# EAGLE schematic battery_monitor_6803-2_Rev3 (EAGLE 7.3.0)
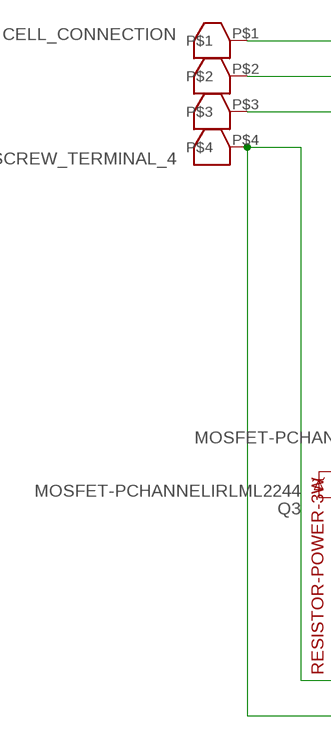
[diagram p0: schematic, sheet 1, part 1 of 2]
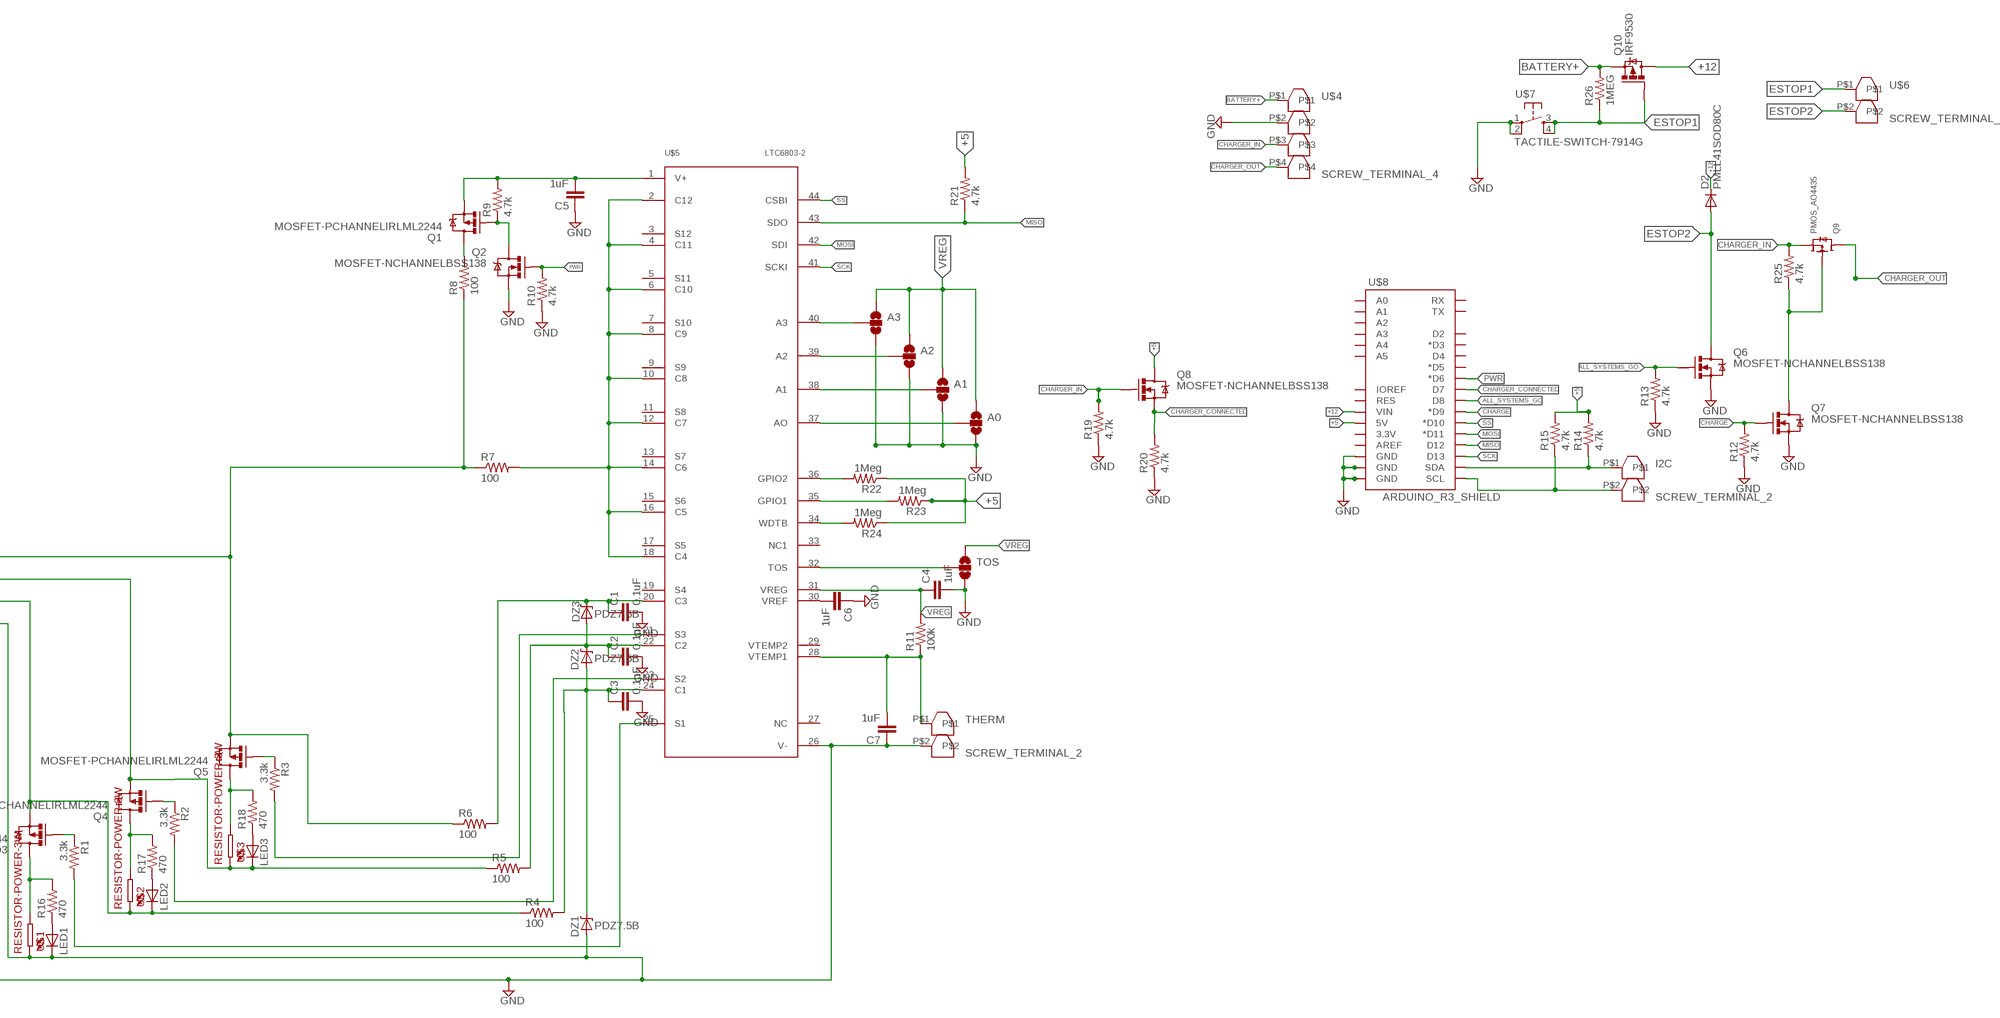
[diagram p1: schematic, sheet 1, part 2 of 2]

## Parts
A0  SOLDERJUMPER_2WAYS  [SJ_3]
A1  SOLDERJUMPER_2WAYS  [SJ_3]
A2  SOLDERJUMPER_2WAYS  [SJ_3]
A3  SOLDERJUMPER_2WAYS  [SJ_3]
C1  0.1uF  0.1UF-100V-10%(0603)  [0603-CAP]
C2  0.1uF  0.1UF-100V-10%(0603)  [0603-CAP]
C3  0.1uF  0.1UF-100V-10%(0603)  [0603-CAP]
C4  1uF  0.1UF-100V-10%(0603)  [0603-CAP]
C5  1uF  0.1UF-100V-10%(0603)  [0603-CAP]
C6  1uF  0.1UF-100V-10%(0603)  [0603-CAP]
C7  1uF  0.1UF-100V-10%(0603)  [0603-CAP]
CELL_CONNECTION  SCREW_TERMINAL_4  [SCREW_TERMINAL_4]
D2  PMLL41SOD80C  [SOD80C]
DZ1  PDZ7.5B  DIODE-ZENER-BZT52  [SOD-323]
DZ2  PDZ7.5B  DIODE-ZENER-BZT52  [SOD-323]
DZ3  PDZ7.5B  DIODE-ZENER-BZT52  [SOD-323]
I2C  SCREW_TERMINAL_2  [SCREW_TERMINAL_2]
LED1  LED0603  [LED-0603]
LED2  LED0603  [LED-0603]
LED3  LED0603  [LED-0603]
Q1  MOSFET-PCHANNELIRLML2244  [SOT23-3]
Q2  MOSFET-NCHANNELBSS138  [SOT23]
Q3  MOSFET-PCHANNELIRLML2244  [SOT23-3]
Q4  MOSFET-PCHANNELIRLML2244  [SOT23-3]
Q5  MOSFET-PCHANNELIRLML2244  [SOT23-3]
Q6  MOSFET-NCHANNELBSS138  [SOT23]
Q7  MOSFET-NCHANNELBSS138  [SOT23]
Q8  MOSFET-NCHANNELBSS138  [SOT23]
Q9  PMOS_AO4435  [SOIC8]
Q10  IRF9530  [TO220BV]
R1  3.3k  3.3KOHM1/10W1%(0603)  [0603-RES]
R2  3.3k  3.3KOHM1/10W1%(0603)  [0603-RES]
R3  3.3k  3.3KOHM1/10W1%(0603)  [0603-RES]
R4  100  3.3KOHM1/10W1%(0603)  [0603-RES]
R5  100  3.3KOHM1/10W1%(0603)  [0603-RES]
R6  100  3.3KOHM1/10W1%(0603)  [0603-RES]
R7  100  3.3KOHM1/10W1%(0603)  [0603-RES]
R8  100  3.3KOHM1/10W1%(0603)  [0603-RES]
R9  4.7k  3.3KOHM1/10W1%(0603)  [0603-RES]
R10  4.7k  3.3KOHM1/10W1%(0603)  [0603-RES]
R11  100k  3.3KOHM1/10W1%(0603)  [0603-RES]
R12  4.7k  3.3KOHM1/10W1%(0603)  [0603-RES]
R13  4.7k  3.3KOHM1/10W1%(0603)  [0603-RES]
R14  4.7k  3.3KOHM1/10W1%(0603)  [0603-RES]
R15  4.7k  3.3KOHM1/10W1%(0603)  [0603-RES]
R16  470  3.3KOHM1/10W1%(0603)  [0603-RES]
R17  470  3.3KOHM1/10W1%(0603)  [0603-RES]
R18  470  3.3KOHM1/10W1%(0603)  [0603-RES]
R19  4.7k  3.3KOHM1/10W1%(0603)  [0603-RES]
R20  4.7k  3.3KOHM1/10W1%(0603)  [0603-RES]
R21  4.7k  3.3KOHM1/10W1%(0603)  [0603-RES]
R22  1Meg  3.3KOHM1/10W1%(0603)  [0603-RES]
R23  1Meg  3.3KOHM1/10W1%(0603)  [0603-RES]
R24  1Meg  3.3KOHM1/10W1%(0603)  [0603-RES]
R25  4.7k  3.3KOHM1/10W1%(0603)  [0603-RES]
R26  1MEG  3.3KOHM1/10W1%(0603)  [0603-RES]
THERM  SCREW_TERMINAL_2  [SCREW_TERMINAL_2]
TOS  SOLDERJUMPER_2WAYS  [SJ_3]
U$1  RESISTOR-POWER-3W  [RESISTOR-3W]
U$2  RESISTOR-POWER-3W  [RESISTOR-3W]
U$3  RESISTOR-POWER-3W  [RESISTOR-3W]
U$4  SCREW_TERMINAL_4  [SCREW_TERMINAL_4]
U$5  LTC6803-2  [FSOP-44]
U$6  SCREW_TERMINAL_2  [SCREW_TERMINAL_2]
U$7  TACTILE-SWITCH-7914G  [7914G]
U$8  ARDUINO_R3_SHIELD  [UNO_R3_SHIELD]

## Nets
+5: Q8.3(D) R14.2 R15.2 R21.2 R22.1 R23.1 R24.1 U$8.5V
+12: D2.C Q10.D U$8.VIN
ALL_SYSTEMS_GO: Q6.1(G) R13.2 U$8.D8
BATTERY+: Q10.S R26.2 U$4.P$1
CHARGE: Q7.1(G) R12.2 U$8.D9(*D9)
CHARGER_CONNECTED: Q8.2(S) R20.2 U$8.D7
CHARGER_IN: Q8.1(G) Q9.1(SOURCE) Q9.2(SOURCE) Q9.3(SOURCE) R19.2 R25.2 U$4.P$3
CHARGER_OUT: Q9.5(DRAIN) Q9.6(DRAIN) Q9.7(DRAIN) Q9.8(DRAIN) U$4.P$4
ESTOP1: Q10.G R26.1 U$6.P$1 U$7.3 U$7.4
ESTOP2: D2.A Q6.3(D) U$6.P$2
GND: A0.3 A1.3 A2.3 A3.3 C1.2 C2.2 C3.2 C4.2 C5.1 C6.1 C7.1 CELL_CONNECTION.P$4 DZ1.2(A) LED1.C Q2.2(S) Q6.2(S) Q7.2(S) R10.1 R12.1 R13.1 R19.1 R20.1 THERM.P$2 TOS.3 U$1.P$2 U$4.P$2 U$5.26(V-) U$7.1 U$7.2 U$8.GND@0(GND) U$8.GND@1(GND) U$8.GND@2(GND)
MISO: R21.1 U$5.43(SDO) U$8.D12
MOSI: U$5.42(SDI) U$8.D11(*D11)
N$1: Q7.3(D) Q9.4(GATE) R25.1
N$2: CELL_CONNECTION.P$3 LED2.C Q3.2(S) R4.1 U$2.P$2
N$3: CELL_CONNECTION.P$2 LED3.C Q4.2(S) R5.1 U$3.P$2
N$4: CELL_CONNECTION.P$1 Q5.2(S) R6.1 R7.1 R8.1
N$5: Q3.3(D) R16.2 U$1.P$1
N$6: R2.2 U$5.23(S2)
N$7: Q3.1(G) R1.1
N$8: R1.2 U$5.25(S1)
N$9: R3.2 U$5.21(S3)
N$10: Q4.3(D) R17.2 U$2.P$1
N$11: Q4.1(G) R2.1
N$12: Q5.3(D) R18.2 U$3.P$1
N$13: LED1.A R16.1
N$14: C1.1 DZ3.1(C) R6.2 U$5.20(C3)
N$15: C3.1 DZ1.1(C) DZ2.2(A) R4.2 U$5.24(C1)
N$16: C2.1 DZ2.1(C) DZ3.2(A) R5.2 U$5.22(C2)
N$17: R7.2 U$5.2(C12) U$5.4(C11) U$5.6(C10) U$5.8(C9) U$5.10(C8) U$5.12(C7) U$5.14(C6) U$5.16(C5) U$5.18(C4)
N$18: Q1.3(D) R8.2
N$19: C5.2 Q1.2(S) R9.2 U$5.1(V+)
N$20: Q1.1(G) Q2.3(D) R9.1
N$21: C7.2 R11.1 THERM.P$1 U$5.28(VTEMP1)
N$22: LED2.A R17.1
N$23: LED3.A R18.1
N$24: R22.2 U$5.36(GPIO2)
N$25: R23.2 U$5.35(GPIO1)
N$27: R24.2 U$5.34(WDTB)
N$28: A3.2 U$5.40(A3)
N$29: Q5.1(G) R3.1
N$30: A2.2 U$5.39(A2)
N$31: A1.2 U$5.38(A1)
N$32: A0.2 U$5.37(AO)
N$33: TOS.2 U$5.32(TOS)
N$34: C6.2 U$5.30(VREF)
PWR: Q2.1(G) R10.2 U$8.D6(*D6)
SCK: U$5.41(SCKI) U$8.D13
SCL: I2C.P$2 R15.1 U$8.SCL
SDA: I2C.P$1 R14.1 U$8.SDA
SS: U$5.44(CSBI) U$8.D10(*D10)
VREG: A0.1 A1.1 A2.1 A3.1 C4.1 R11.2 TOS.1 U$5.31(VREG)
Unconnected: U$5.3(S12) U$5.5(S11) U$5.7(S10) U$5.9(S9) U$5.11(S8) U$5.13(S7) U$5.15(S6) U$5.17(S5) U$5.19(S4) U$5.27(NC) U$5.29(VTEMP2) U$5.33(NC1) U$8.3.3V U$8.A0 U$8.A1 U$8.A2 U$8.A3 U$8.A4 U$8.A5 U$8.AREF U$8.D2 U$8.D3(*D3) U$8.D4 U$8.D5(*D5) U$8.IOREF U$8.RES U$8.RX U$8.TX

## Library data of the parts
A0 A1-A3 TOS = SparkFun:SOLDERJUMPER_2WAY: Solder Jumper 2 way solder jumper; OC_NEWARK: unknown
C1-C3 = SparkFun-Capacitors:0.1UF-100V-10%(0603): CAP-08390; MF: AVX CORPORATION; MPN: 0603YG104ZAT2A; OC_NEWARK: 01H6821; PROD_ID: CAP-08390
C4-C7 = SparkFun-Capacitors:0.1UF-100V-10%(0603): CAP-08390; MPN: C0603X5R0J105M030BC; OC_NEWARK: 04X3184; PROD_ID: CAP-08390; VALUE: 0.1uF
CELL_CONNECTION U$4 = isaac1:SCREW_TERMINAL_4; MF: TYCO ELECTRONICS; MPN: 282834-4; OC_NEWARK: 12H8388
D2 = diode:PMLL41*: High-speed diodes Source: http://www.semiconductors.philips.com/acrobat_download/datasheets/PMLL4150_2.pdf; MF: FAIRCHILD SEMICONDUCTOR; MPN: FDLL4148; OC_NEWARK: 18C6408
DZ1-DZ3 = SparkFun-DiscreteSemi:DIODE-ZENER: Zener Diode Production Part - 8199 3.4V Zener Voltage; MPN: PDZ7.5B,115; OC_NEWARK: 04X4941
I2C THERM = isaac1:SCREW_TERMINAL_2; MF: TYCO ELECTRONICS; MPN: 282834-2; OC_NEWARK: 12H8386
LED1-LED3 = SparkFun-LED:LED: LEDs Standard schematic elements and footprints for 5mm, 3mm, 1206, and 0603 sized LEDs. 5mm - Spark Fun Electronics SKU : COM-00529 (and others); MPN: 150060RS75000; OC_NEWARK: 95W3795
Q1 Q3-Q5 = SparkFun-DiscreteSemi:MOSFET-PCHANNEL: Generic PMOSFET; MPN: SI2369DS-T1-GE3; OC_NEWARK: 40X8697; PROD_ID: TRANS-11153
Q2 Q6-Q8 = SparkFun-DiscreteSemi:MOSFET-NCHANNEL: Common NMOSFET Parts MFG P/N Store ID Prod ID FDD8780 TRANS-09984 SI7820DN TRANS-11055 FDS6630A IC-08089 2N7002PW TRANS-11151 FQP30N06L COM-10213 TRANS-10060 BSS123LT1G TRANS-08345 BSS138 TRANS-00830 BS170 2N7000; MPN: IRLML0030TRPBF; OC_NEWARK: 52R2613; PROD_ID: TRANS-00830
Q9 = isaac1:PMOS_AO4435; MPN: SI9407BDY-T1-GE3; OC_NEWARK: 16P3885
Q10 = Adams Chips:IRF9530: P-CHANNEL HEXFET POWER-MOS-FET Source: http://www.irf.com/product-info/datasheets/data/irf9530.pdf; MPN: NTE2383; OC_NEWARK: 14T4215
R1-R3 = SparkFun-Resistors:3.3KOHM1/10W1%(0603): RES-07851; MF: VISHAY/DALE; MPN: CRCW06033K00FKEA; OC_NEWARK: 52K8368; PROD_ID: RES-07851
R4-R8 = SparkFun-Resistors:3.3KOHM1/10W1%(0603): RES-07851; MPN: ERJ-1GNF1000C; OC_NEWARK: 05X8794; PROD_ID: RES-07851
R9 R10 R12-R15 R19-R21 R25 = SparkFun-Resistors:3.3KOHM1/10W1%(0603): RES-07851; MF: VISHAY/DALE; MPN: CRCW06034K70FKEA; OC_NEWARK: 52K8494; PROD_ID: RES-07851
R11 = SparkFun-Resistors:3.3KOHM1/10W1%(0603): RES-07851; MF: FARNELL; MPN: MC0063W06035100K; OC_NEWARK: 39K0075; PROD_ID: RES-07851
R16-R18 = SparkFun-Resistors:3.3KOHM1/10W1%(0603): RES-07851; MPN: ERJ-P03F4700V; OC_NEWARK: 05X8640; PROD_ID: RES-07851
R22-R24 R26 = SparkFun-Resistors:3.3KOHM1/10W1%(0603): RES-07851; MPN: ERJ-3EKF1004V; OC_NEWARK: 64R5311; PROD_ID: RES-07851
U$1-U$3 = isaac1:RESISTOR-POWER-3W: PR03 series .205" dia x .657" L; MPN: ERG-3SJ200; OC_NEWARK: 52W7905
U$5 = isaac1:LTC6803-2; OC_NEWARK: unknown
U$6 = Isaac:SCREW_TERMINAL_2; MF: TYCO ELECTRONICS; MPN: 282834-2; OC_NEWARK: 12H8386
U$7 = GeekAmmo:TACTILE-SWITCH: Tactile Switch 4 Pins, SPST NO; MF: BOURNS, INC.; MPN: 7914G-1-000E; OC_NEWARK: 05B2757
U$8 = SparkFun-Boards:ARDUINO_R3_SHIELD: Shield form compatible with the Arduino Uno R3.; OC_NEWARK: unknown